# EAGLE design msl (EAGLE 6.3)
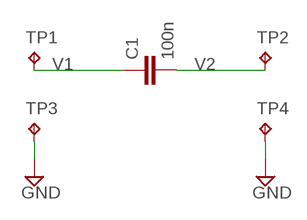
[diagram p0: schematic, sheet 1]

## Parts
C1  100n  C-EUC0402K  [C0402K]
TP1  TPTP06SQ  [TP06SQ]
TP2  TPTP06SQ  [TP06SQ]
TP3  TPTP06SQ  [TP06SQ]
TP4  TPTP06SQ  [TP06SQ]

## Nets
GND: TP3.TP TP4.TP
V1: C1.1 TP1.TP
V2: C1.2 TP2.TP

## Library data of the parts
C1 = msl:C-EU: CAPACITOR, European symbol
TP1-TP4 = msl:TP: Test pad

## Board
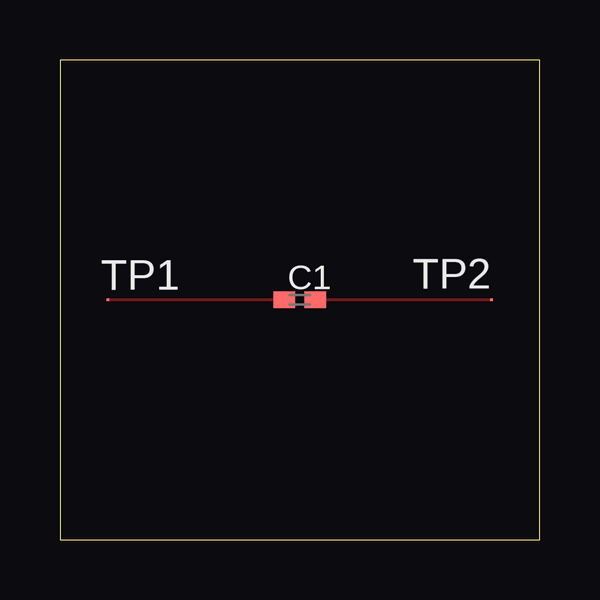
[diagram p1: board, top side]
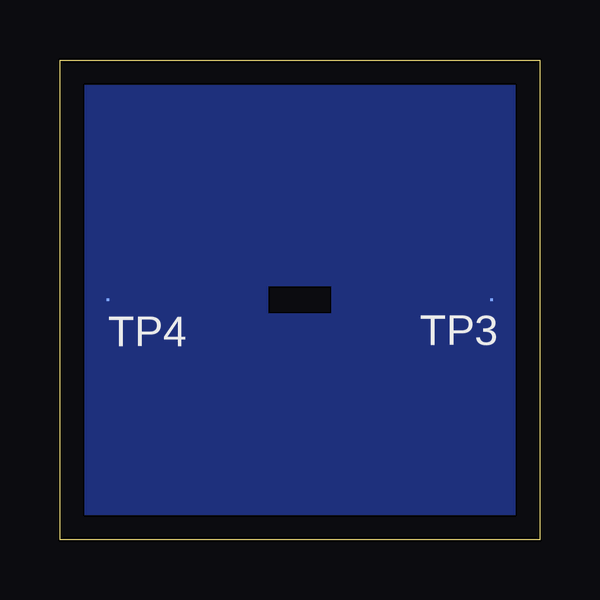
[diagram p2: board, bottom side, seen from below]

Size 20 x 20 mm. Coordinates in mm from the lower left corner, seen from the top.
Outline: 0,0 20,0 20,20 0,20 0,0
Copper layers (1*16): Top 0.0356mm / dielectric 0.32mm / Bottom 0.0356mm
Design rules "default *": minimum track width 10mil, minimum drill 24mil, track to track 8mil, track to pad 8mil, pad to pad 8mil, via to via 8mil, smd to smd 8mil, copper to edge 40mil, drill to drill 8mil, minimum pad ring 10mil, minimum via ring 8mil, stop-mask expansion 4mil, vias tented up to drill 0mil, thermal gap 10mil
bRestrict: area 8.7,9.4 to 11.3,10.6

### Footprints (pad centres in the part's own frame; a part is rotated, then mirrored left to right if it is on the bottom)
C0402K = smd 0.9 x 0.7: 1 -0.65,0; 2 0.65,0
TP06SQ = smd 0.102 x 0.102: TP 0,0

### Placement (x,y rotation side)
C1  10,10 0 top
TP1  2,10 0 top
TP2  18,10 0 top
TP3  2,10 0 bottom
TP4  18,10 0 bottom

### Tracks (layer width: path | path; a pad name or v marks a point on that pad's centre or on a via)
GND
  pour Bottom (no thermals): 19,1 1,1 1,19 19,19
V1
  pour Top (no thermals): 1.95,10.05 9.2,10.05 9.2,9.95 1.95,9.95
V2
  pour Top (no thermals): 10.5,10.05 18.05,10.05 18.05,9.95 10.5,9.95